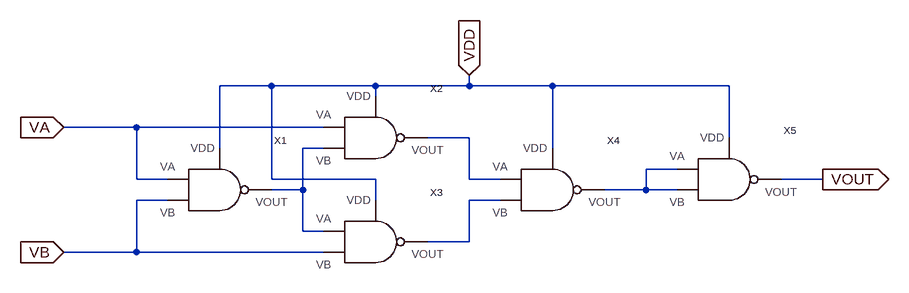
[diagram p0: schematic xnor.asc]
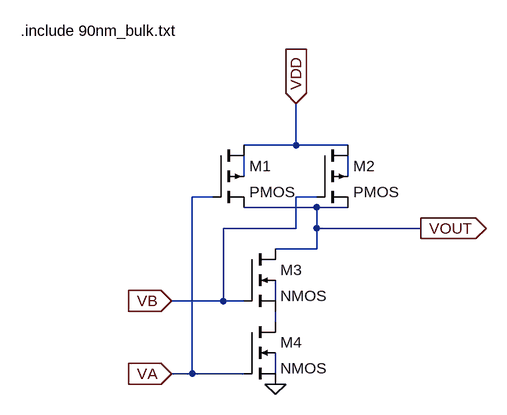
[diagram p1: sub-circuit nand.asc]
xnor.asc, the LTspice schematic file:
Version 4
SHEET 1 1196 680
WIRE 224 0 144 0
WIRE 384 0 224 0
WIRE 528 0 528 -16
WIRE 528 0 384 0
WIRE 656 0 528 0
WIRE 928 0 656 0
WIRE 384 16 384 0
WIRE 16 64 -96 64
WIRE 304 64 16 64
WIRE 528 80 464 80
WIRE 928 80 928 0
WIRE 144 96 144 0
WIRE 304 96 272 96
WIRE 656 96 656 0
WIRE 848 128 800 128
WIRE 16 144 16 64
WIRE 64 144 16 144
WIRE 224 144 224 0
WIRE 384 144 224 144
WIRE 528 144 528 80
WIRE 576 144 528 144
WIRE 1072 144 1008 144
WIRE 272 160 272 96
WIRE 272 160 224 160
WIRE 800 160 800 128
WIRE 800 160 736 160
WIRE 848 160 800 160
WIRE 64 176 16 176
WIRE 384 176 384 144
WIRE 576 176 528 176
WIRE 272 224 272 160
WIRE 304 224 272 224
WIRE 528 240 528 176
WIRE 528 240 464 240
WIRE 16 256 16 176
WIRE 16 256 -96 256
WIRE 304 256 16 256
FLAG 528 -16 VDD
IOPIN 528 -16 In
FLAG -96 64 VA
IOPIN -96 64 In
FLAG -96 256 VB
IOPIN -96 256 In
FLAG 1072 144 VOUT
IOPIN 1072 144 Out
SYMBOL nand 128 144 R0
SYMATTR InstName X1
SYMBOL nand 368 64 R0
SYMATTR InstName X2
SYMBOL nand 368 224 R0
SYMATTR InstName X3
SYMBOL nand 640 144 R0
SYMATTR InstName X4
SYMBOL nand 912 128 R0
SYMATTR InstName X5

nand.asc, the sub-circuit schematic file:
Version 4
SHEET 1 880 696
WIRE 496 272 496 208
WIRE 496 272 416 272
WIRE 576 272 496 272
WIRE 416 320 416 288
WIRE 576 320 576 288
WIRE 368 352 336 352
WIRE 528 352 496 352
WIRE 528 368 416 368
WIRE 576 368 528 368
WIRE 496 400 496 352
WIRE 496 400 384 400
WIRE 528 400 528 368
WIRE 688 400 528 400
WIRE 528 432 528 400
WIRE 528 432 464 432
WIRE 384 512 384 400
WIRE 384 512 304 512
WIRE 416 512 384 512
WIRE 464 512 464 480
WIRE 464 544 464 528
WIRE 336 624 336 352
WIRE 336 624 304 624
WIRE 416 624 336 624
WIRE 464 624 464 592
FLAG 304 624 VA
IOPIN 304 624 In
FLAG 304 512 VB
IOPIN 304 512 In
FLAG 496 208 VDD
IOPIN 496 208 In
FLAG 688 400 VOUT
IOPIN 688 400 Out
FLAG 464 640 0
SYMBOL nmos4 416 432 R0
SYMATTR InstName M3
SYMATTR Value2 l=90n w=200n
SYMBOL nmos4 416 544 R0
SYMATTR InstName M4
SYMATTR Value2 l=90n w=200n
SYMBOL pmos4 368 272 R0
SYMATTR InstName M1
SYMATTR Value2 l=90n w=400n
SYMBOL pmos4 528 272 R0
SYMATTR InstName M2
SYMATTR Value2 l=90n w=400n
TEXT 72 96 Left 2 !.include 90nm_bulk.txt

The netlist it stands for:
* xnor.asc
XX1 VA VB VDD N002 nand
XX2 VA N002 VDD N001 nand
XX3 N002 VB VDD N004 nand
XX4 N001 N004 VDD N003 nand
XX5 N003 N003 VDD VOUT nand

* block symbol definitions
.subckt nand VA VB VDD VOUT
M3 VOUT VB N004 N003 NMOS l=90n w=200n
M4 N004 VA 0 N005 NMOS l=90n w=200n
M1 VDD VA VOUT N001 PMOS l=90n w=400n
M2 VDD VB VOUT N002 PMOS l=90n w=400n
.include 90nm_bulk.txt
.ends nand

.model NMOS NMOS
.model PMOS PMOS
.lib standard.mos
.backanno
.end